# Altium schematic sheet FOC_MCU.SchDoc
size 381 x 241 mm; SheetNumber: 1; SheetTotal: 3
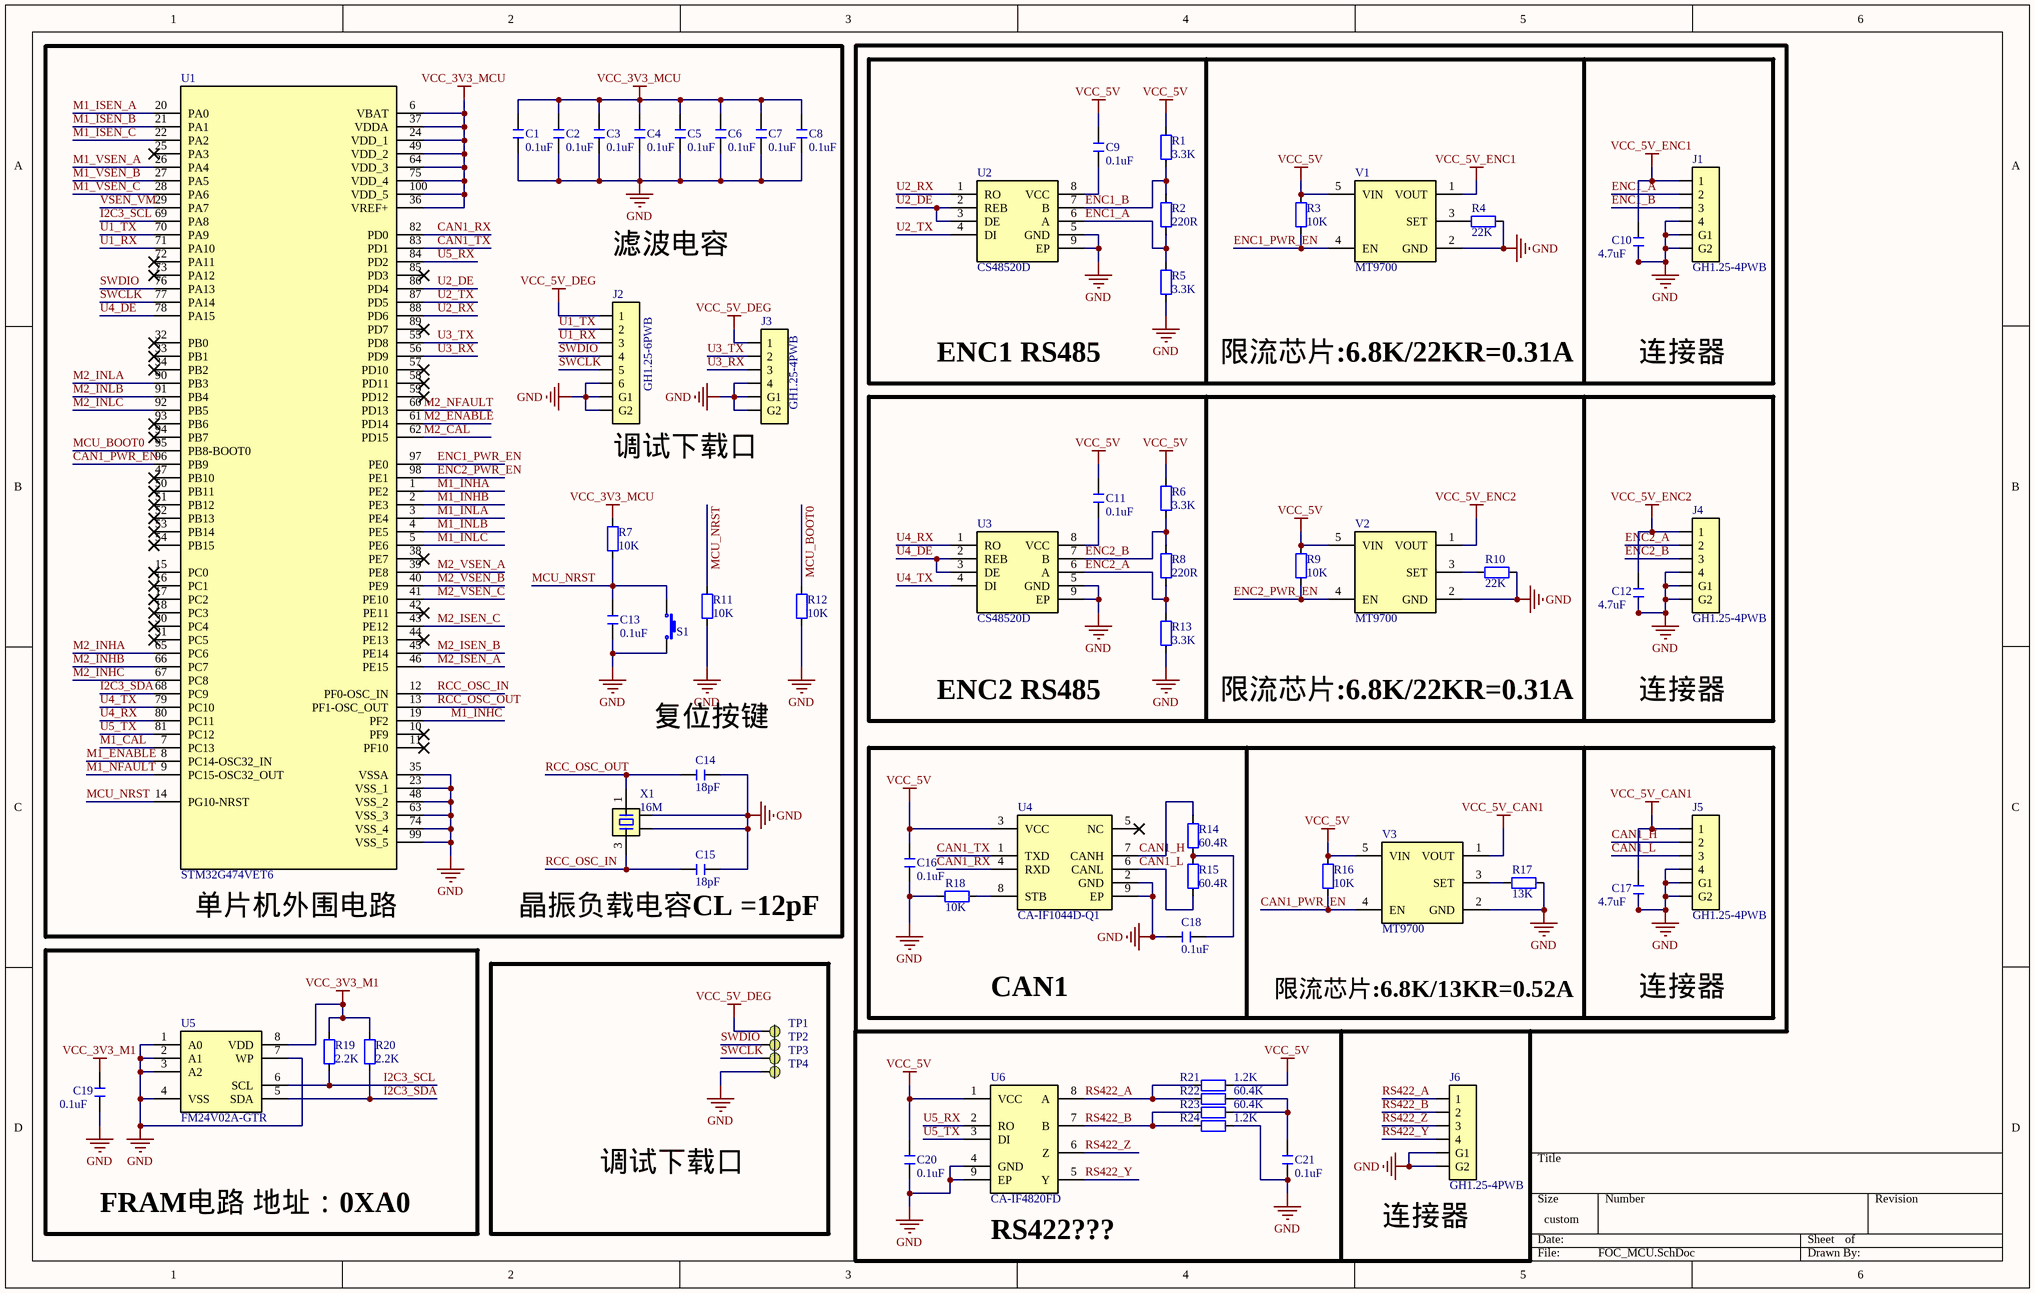
[diagram p0: FOC_MCU.SchDoc]

## Parts
C1  0.1uF  [C 0603_L]
C2  0.1uF  [C 0603_L]
C3  0.1uF  [C 0603_L]
C4  0.1uF  [C 0603_L]
C5  0.1uF  [C 0603_L]
C6  0.1uF  [C 0603_L]
C7  0.1uF  [C 0603_L]
C8  0.1uF  [C 0603_L]
C9  0.1uF  [C 0603_L]
C10  4.7uF  [C 0603_L]
C11  0.1uF  [C 0603_L]
C12  4.7uF  [C 0603_L]
C13  0.1uF  [C 0603_L]
C14  18pF  [C 0603_L]
C15  18pF  [C 0603_L]
C16  0.1uF  [C 0603_L]
C17  4.7uF  [C 0603_L]
C18  0.1uF  [C 0603_L]
C19  0.1uF  [C 0603_L]
C20  0.1uF  [C 0603_L]
C21  0.1uF  [C 0603_L]
J1  GH1.25-4PWB  [GH1.25-4PWB]
J2  GH1.25-6PWB  [GH1.25-6PWB]
J3  GH1.25-4PWB  [GH1.25-4PWB]
J4  GH1.25-4PWB  [GH1.25-4PWB]
J5  GH1.25-4PWB  [GH1.25-4PWB]
J6  GH1.25-4PWB  [GH1.25-4PWB]
R1  3.3K  [R 0603_L]
R2  220R  [R 0603_L]
R3  10K  [R 0603_L]
R4  22K  [R 0603_L]
R5  3.3K  [R 0603_L]
R6  3.3K  [R 0603_L]
R7  10K  [R 0603_L]
R8  220R  [R 0603_L]
R9  10K  [R 0603_L]
R10  22K  [R 0603_L]
R11  10K  [R 0603_L]
R12  10K  [R 0603_L]
R13  3.3K  [R 0603_L]
R14  60.4R  [R 0603_L]
R15  60.4R  [R 0603_L]
R16  10K  [R 0603_L]
R17  13K  [R 0603_L]
R18  10K  [R 0603_L]
R19  2.2K  [R 0603_L]
R20  2.2K  [R 0603_L]
R21  1.2K  [R 0603_L]
R22  60.4K  [R 0603_L]
R23  60.4K  [R 0603_L]
R24  1.2K  [R 0603_L]
S1  TS-1089S-02526  [SMD_TS-1089S]  (value not drawn)
TP1  (no value)  [TP_RECT_2x2]
TP2  (no value)  [TP_RECT_2x2]
TP3  (no value)  [TP_RECT_2x2]
TP4  (no value)  [TP_RECT_2x2]
U1  STM32G474VET6  [LQFP100_L]
U2  CS48520D  [DFN65P300X75-9N]
U3  CS48520D  [DFN65P300X75-9N]
U4  CA-IF1044D-Q1  [DFN65P300X75-9N]
U5  FM24V02A-GTR  [SOIC-8N]
U6  CA-IF4820FD  [DFN65P300X75-9N]
V1  MT9700  [SOT-23-5]
V2  MT9700  [SOT-23-5]
V3  MT9700  [SOT-23-5]
X1  16M  [OSC 2016-4P]

## Blocks framed on the sheet
FRAM电路 地址：0XA0: C19 R19 R20 U5
调试下载口: TP1-TP4

## Nets
GND: C1.2 C2.2 C3.2 C4.2 C5.2 C6.2 C7.2 C8.2 C10.1 C12.1 C13.2 C14.1 C15.1 C16.1 C17.1 C18.1 C19.1 C20.1 C21.1 J1.4 J1.G1 J1.G2 J2.6 J2.G1 J2.G2 J3.4 J3.G1 J3.G2 J4.4 J4.G1 J4.G2 J5.4 J5.G1 J5.G2 J6.G1 J6.G2 R4.1 R5.1 R10.1 R11.2 R12.2 R13.1 R17.1 R18.2 R24.1 S1.1 TP4.1 U1.23(VSS_1) U1.35(VSSA) U1.48(VSS_2) U1.63(VSS_3) U1.74(VSS_4) U1.99(VSS_5) U2.5(GND) U2.9(EP) U3.5(GND) U3.9(EP) U4.2(GND) U4.9(EP) U5.1(A0) U5.2(A1) U5.3(A2) U5.4(VSS) U5.7(WP) U6.4(GND) U6.9(EP) V1.2(GND) V2.2(GND) V3.2(GND) X1.2 X1.4
VCC_3V3_M1: C19.2 R19.2 R20.2 U5.8(VDD)
VCC_3V3_MCU: C1.1 C2.1 C3.1 C4.1 C5.1 C6.1 C7.1 C8.1 R7.1 U1.6(VBAT) U1.24(VDD_1) U1.36(VREF+) U1.37(VDDA) U1.49(VDD_2) U1.64(VDD_3) U1.75(VDD_4) U1.100(VDD_5)
VCC_5V: C9.2 C11.2 C16.2 C20.2 R1.2 R3.2 R6.2 R9.2 R16.2 R21.1 U4.3(VCC) U6.1(VCC) V1.5(VIN) V2.5(VIN) V3.5(VIN)
VCC_5V_CAN1: C17.2 J5.1 V3.1(VOUT)
VCC_5V_DEG: J2.1 J3.1 TP1.1
VCC_5V_ENC1: C10.2 J1.1 V1.1(VOUT)
VCC_5V_ENC2: C12.2 J4.1 V2.1(VOUT)
CAN1_H: J5.2 R14.1 U4.7(CANH)
CAN1_L: J5.3 R15.2 U4.6(CANL)
CAN1_PWR_EN: R16.1 U1.96(PB9) V3.4(EN)
CAN1_RX: U1.82(PD0) U4.4(RXD)
CAN1_TX: U1.83(PD1) U4.1(TXD)
ENC1_A: J1.2 R2.1 R5.2 U2.6(A)
ENC1_B: J1.3 R1.1 R2.2 U2.7(B)
ENC1_PWR_EN: R3.1 U1.97(PE0) V1.4(EN)
ENC2_A: J4.2 R8.1 R13.2 U3.6(A)
ENC2_B: J4.3 R6.1 R8.2 U3.7(B)
ENC2_PWR_EN: R9.1 U1.98(PE1) V2.4(EN)
I2C3_SCL: R19.1 U1.69(PA8) U5.6(SCL)
I2C3_SDA: R20.1 U1.68(PC9) U5.5(SDA)
M1_CAL: U1.7(PC13)
M1_ENABLE: U1.8(PC14-OSC32_IN)
M1_INHA: U1.1(PE2)
M1_INHB: U1.2(PE3)
M1_INHC: U1.19(PF2)
M1_INLA: U1.3(PE4)
M1_INLB: U1.4(PE5)
M1_INLC: U1.5(PE6)
M1_ISEN_A: U1.20(PA0)
M1_ISEN_B: U1.21(PA1)
M1_ISEN_C: U1.22(PA2)
M1_NFAULT: U1.9(PC15-OSC32_OUT)
M1_VSEN_A: U1.26(PA4)
M1_VSEN_B: U1.27(PA5)
M1_VSEN_C: U1.28(PA6)
M2_CAL: U1.62(PD15)
M2_ENABLE: U1.61(PD14)
M2_INHA: U1.65(PC6)
M2_INHB: U1.66(PC7)
M2_INHC: U1.67(PC8)
M2_INLA: U1.90(PB3)
M2_INLB: U1.91(PB4)
M2_INLC: U1.92(PB5)
M2_ISEN_A: U1.46(PE15)
M2_ISEN_B: U1.45(PE14)
M2_ISEN_C: U1.43(PE12)
M2_NFAULT: U1.60(PD13)
M2_VSEN_A: U1.39(PE8)
M2_VSEN_B: U1.40(PE9)
M2_VSEN_C: U1.41(PE10)
MCU_BOOT0: R12.1 U1.95(PB8-BOOT0)
MCU_NRST: C13.1 R7.2 R11.1 S1.2 U1.14(PG10-NRST)
RCC_OSC_IN: C15.2 U1.12(PF0-OSC_IN) X1.3
RCC_OSC_OUT: C14.2 U1.13(PF1-OSC_OUT) X1.1
RS422_A: J6.1 R21.2 R22.2 U6.8(A)
RS422_B: J6.2 R23.2 R24.2 U6.7(B)
RS422_Y: J6.4 U6.5(Y)
RS422_Z: J6.3 U6.6(Z)
SWCLK: J2.5 TP3.1 U1.77(PA14)
SWDIO: J2.4 TP2.1 U1.76(PA13)
U1_RX: J2.3 U1.71(PA10)
U1_TX: J2.2 U1.70(PA9)
U2_DE: U1.86(PD4) U2.2(REB) U2.3(DE)
U2_RX: U1.88(PD6) U2.1(RO)
U2_TX: U1.87(PD5) U2.4(DI)
U3_RX: J3.3 U1.56(PD9)
U3_TX: J3.2 U1.55(PD8)
U4_DE: U1.78(PA15) U3.2(REB) U3.3(DE)
U4_RX: U1.80(PC11) U3.1(RO)
U4_TX: U1.79(PC10) U3.4(DI)
U5_RX: U1.84(PD2) U6.2(RO)
U5_TX: U1.81(PC12) U6.3(DI)
VSEN_VM: U1.29(PA7)
NetC9_1: C9.1 U2.8(VCC)
NetC11_1: C11.1 U3.8(VCC)
NetC18_2: C18.2 R14.2 R15.1
NetC21_2: C21.2 R22.1 R23.1
NetR4_2: R4.2 V1.3(SET)
NetR10_2: R10.2 V2.3(SET)
NetR17_2: R17.2 V3.3(SET)
NetR18_1: R18.1 U4.8(STB)

Not connected (* = marked no-connect by the designer): U1 10(PF9)* 11(PF10)* 15(PC0)* 16(PC1)* 17(PC2)* 18(PC3)* 25(PA3)* 30(PC4)* 31(PC5)* 32(PB0)* 33(PB1)* 34(PB2)* 38(PE7)* 42(PE11)* 44(PE13)* 47(PB10)* 50(PB11)* 51(PB12)* 52(PB13)* 53(PB14)* 54(PB15)* 57(PD10)* 58(PD11)* 59(PD12)* 72(PA11)* 73(PA12)* 85(PD3)* 89(PD7)* 93(PB6)* 94(PB7)*; U4 5(NC)*

## Notes on the sheet
- 滤波电容
- ENC1 RS485
- 限流芯片:6.8K/22KR=0.31A
- 连接器
- (near J2) 调试下载口
- ENC2 RS485
- 复位按键
- (near U1) 单片机外围电路
- (near C15) 晶振负载电容CL =12pF
- CAN1
- 限流芯片:6.8K/13KR=0.52A
- (near U6) RS422???
- (near J6) 连接器

## Library data of the parts
C1-C21 = C: 贴片电容; BOM名称: 无极性贴片电容
J1 J3-J6 = GH1.25-4PWB: GH1.25-4P 卧贴
J2 = GH1.25-6PWB: GH1.25-6P 卧贴
R1-R24 = R: 贴片电阻; BOM名称: 贴片电阻
TP1-TP4 = TP
U1 = STM32G474VET6: STM32G4系列微处理器
U2 U3 = CS48520D: RS485
U4 = CA-IF1044D-Q1: CAN收发器，5Mbps
U6 = CA-IF4820FD: RS422，3.3V/5V，20Mbps
V1-V3 = MT9700: 功率电子开关
X1 = X201616MOB4SI: 4脚无源晶振，负载电容12pF; BOM名称: 4脚无源晶振